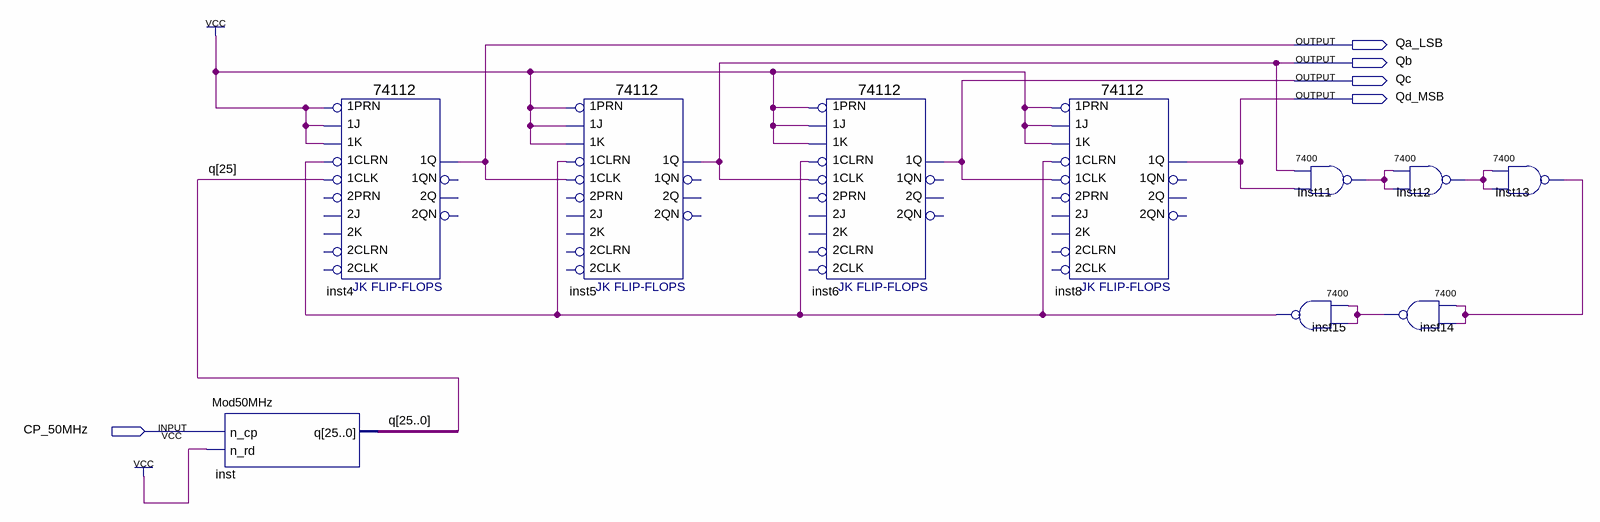
[diagram p0: schematic sheet]
// Quartus schematic eightcounter.bdf as structural Verilog: 10 symbols, 5 pins
module eightcounter (
  input  CP_50MHz,
  output Qa_LSB,
  output Qb,
  output Qc,
  output Qd_MSB
);

  wire inst11_1, inst12_1, inst13_1, inst14_1, inst15_1;
  wire [25:0] q;

  Mod50MHz inst (.n_cp(CP_50MHz), .n_rd(1'b1), .q(q));
  \74112  inst4 (
    .\1K (1'b1), .\1J (1'b1), .\1PRN (1'b1), .\1CLK (q[25]), .\1CLRN (inst15_1), .\1Q (Qa_LSB));  // open: 2K, 2J, 2PRN, 2CLK, 2CLRN, 1QN, 2Q, 2QN
  \74112  inst5 (
    .\1K (1'b1), .\1J (1'b1), .\1PRN (1'b1), .\1CLK (Qa_LSB), .\1CLRN (inst15_1), .\1Q (Qb));  // open: 2K, 2J, 2PRN, 2CLK, 2CLRN, 1QN, 2Q, 2QN
  \74112  inst6 (
    .\1K (1'b1), .\1J (1'b1), .\1PRN (1'b1), .\1CLK (Qb), .\1CLRN (inst15_1), .\1Q (Qc));  // open: 2K, 2J, 2PRN, 2CLK, 2CLRN, 1QN, 2Q, 2QN
  \74112  inst8 (
    .\1K (1'b1), .\1J (1'b1), .\1PRN (1'b1), .\1CLK (Qc), .\1CLRN (inst15_1), .\1Q (Qd_MSB));  // open: 2K, 2J, 2PRN, 2CLK, 2CLRN, 1QN, 2Q, 2QN
  \7400  inst11 (.\3 (Qd_MSB), .\2 (Qb), .\1 (inst11_1));
  \7400  inst15 (.\3 (inst14_1), .\2 (inst14_1), .\1 (inst15_1));
  \7400  inst12 (.\3 (inst11_1), .\2 (inst11_1), .\1 (inst12_1));
  \7400  inst14 (.\3 (inst13_1), .\2 (inst13_1), .\1 (inst14_1));
  \7400  inst13 (.\3 (inst12_1), .\2 (inst12_1), .\1 (inst13_1));
endmodule
